# EasyEDA schematic SCH_Poultry-Farm-Prediction-Models-(Field-and-Gateway-Nodes)_2025-12-15.json

## Sheets
1 Gateway Esp 32: TITLE: ESP Gateway; REV: 1.0; Date: 2025-12-15; Sheet: 1/1; Drawn By: davidorhin; Company: Your Company
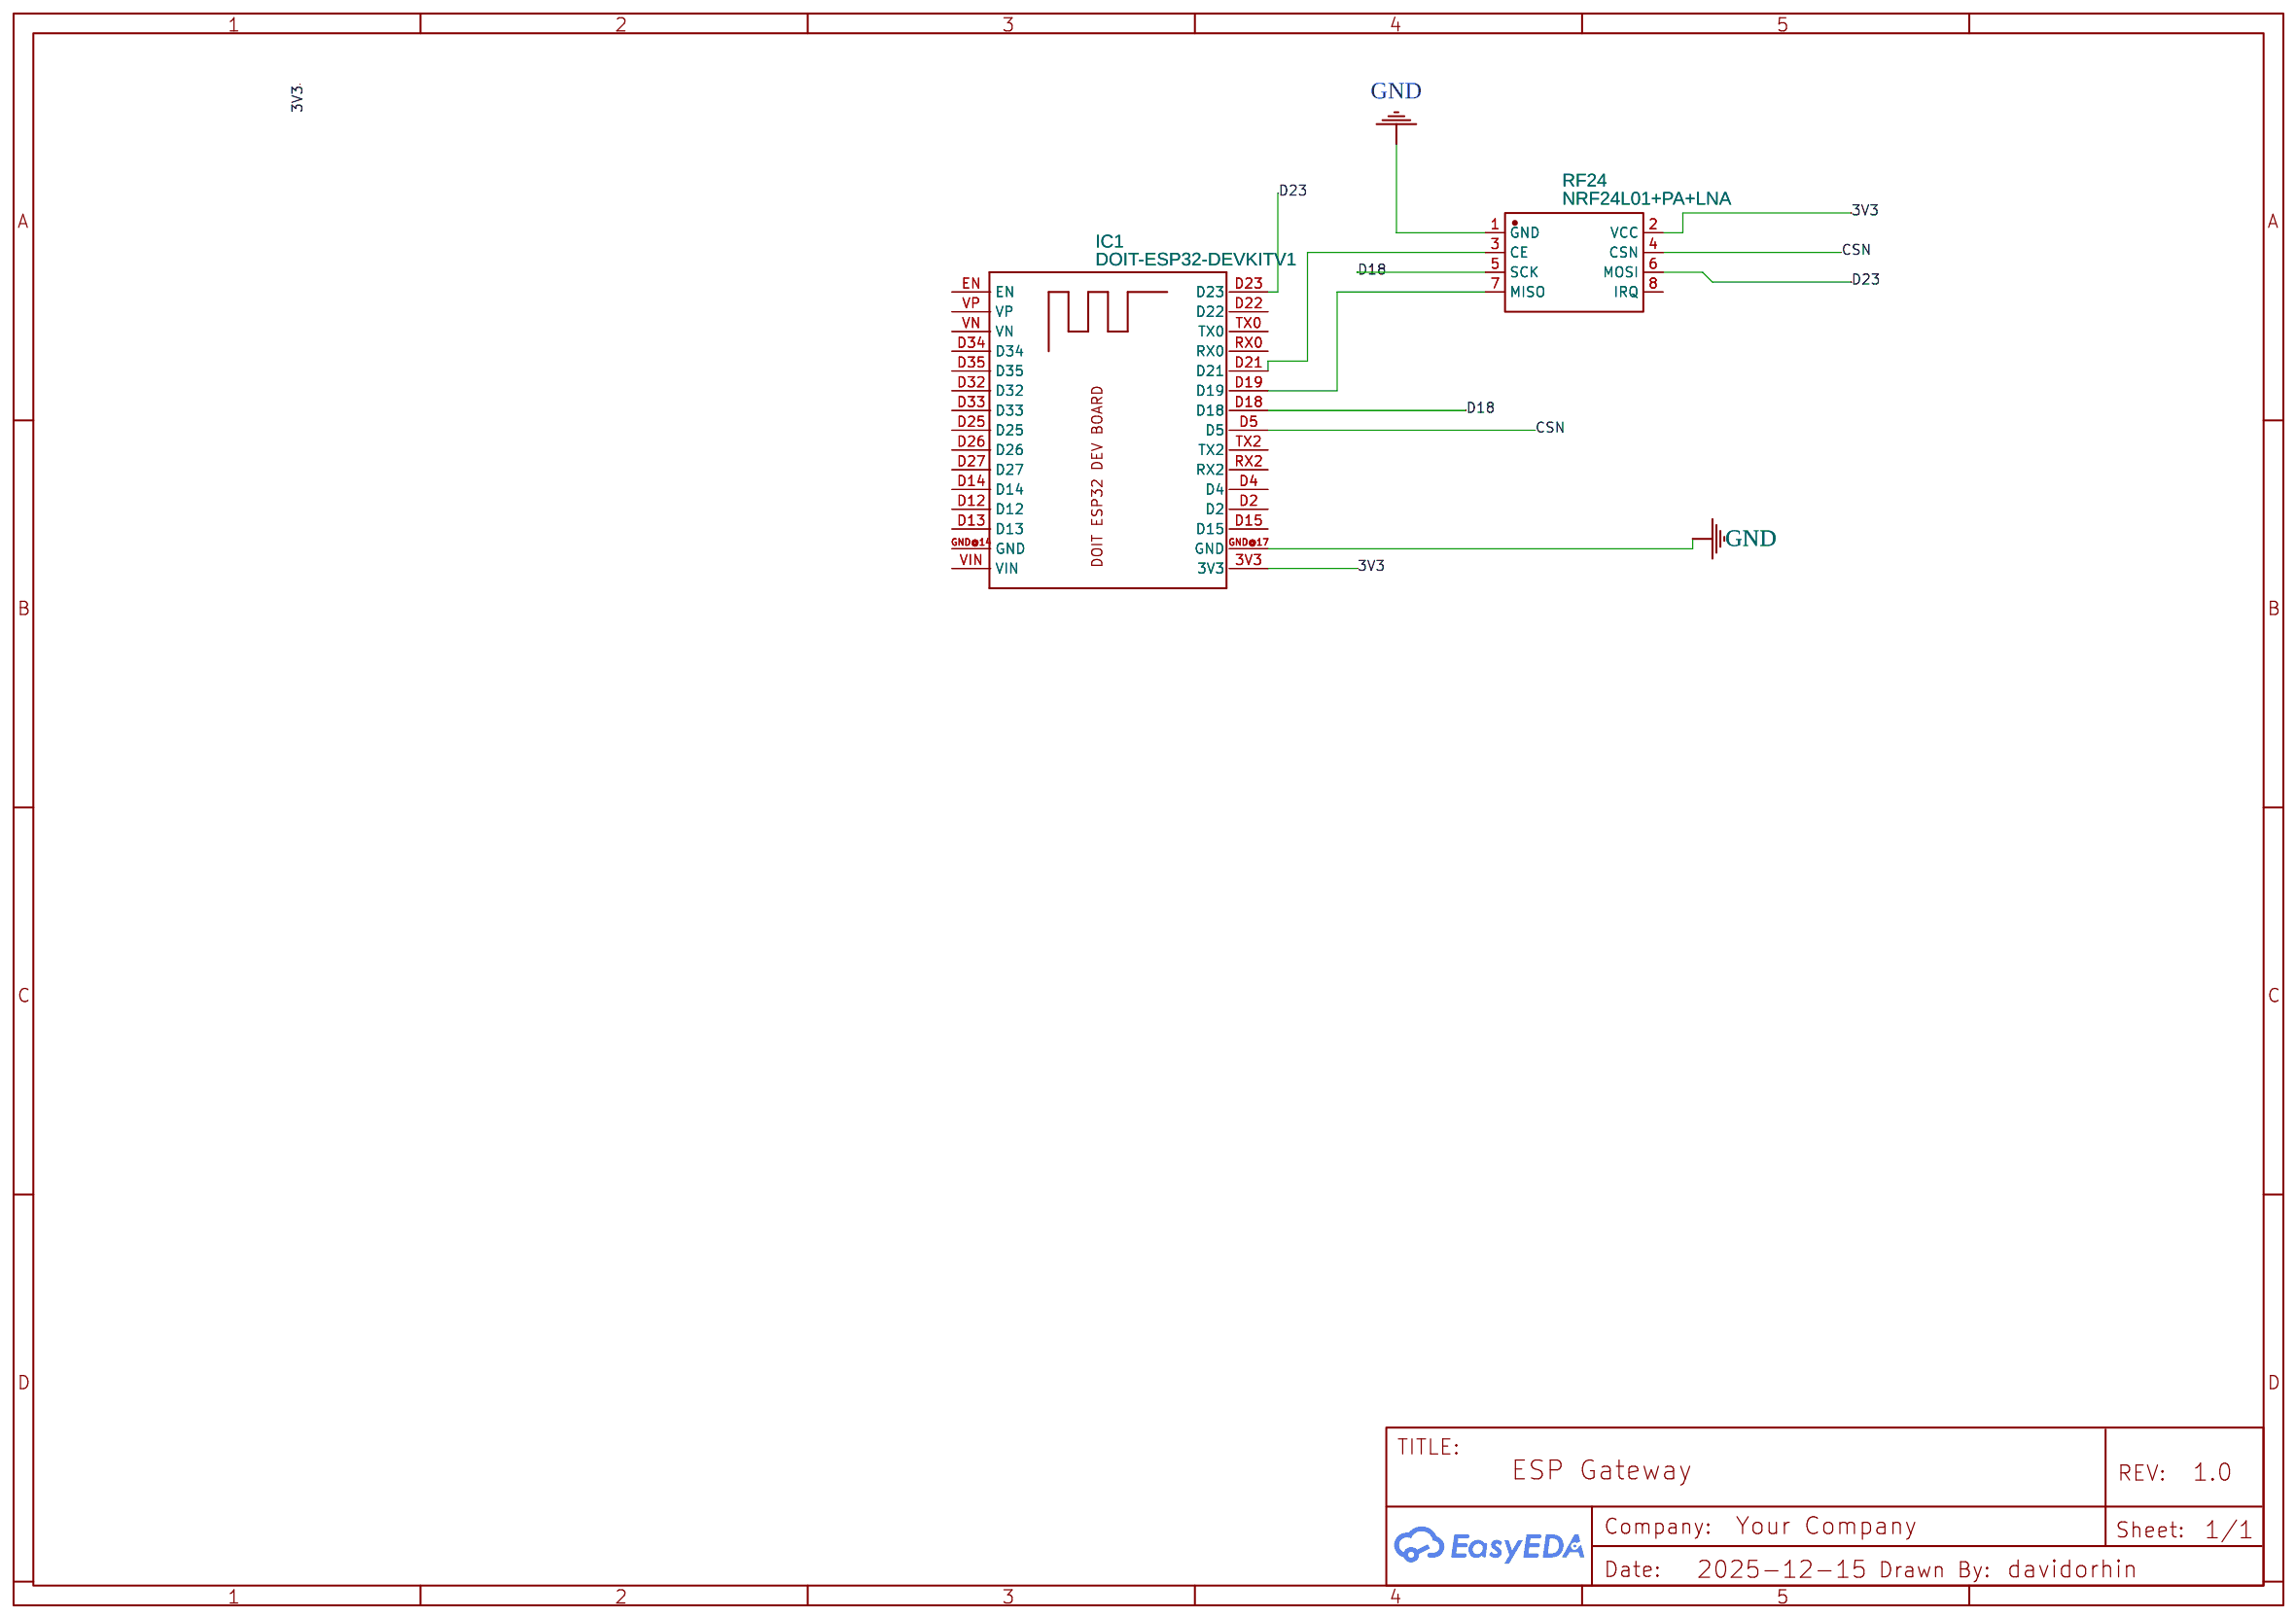
[diagram p0: Gateway Esp 32]
2 Field Nodes Esp 33: TITLE: Node1; Company: Team7
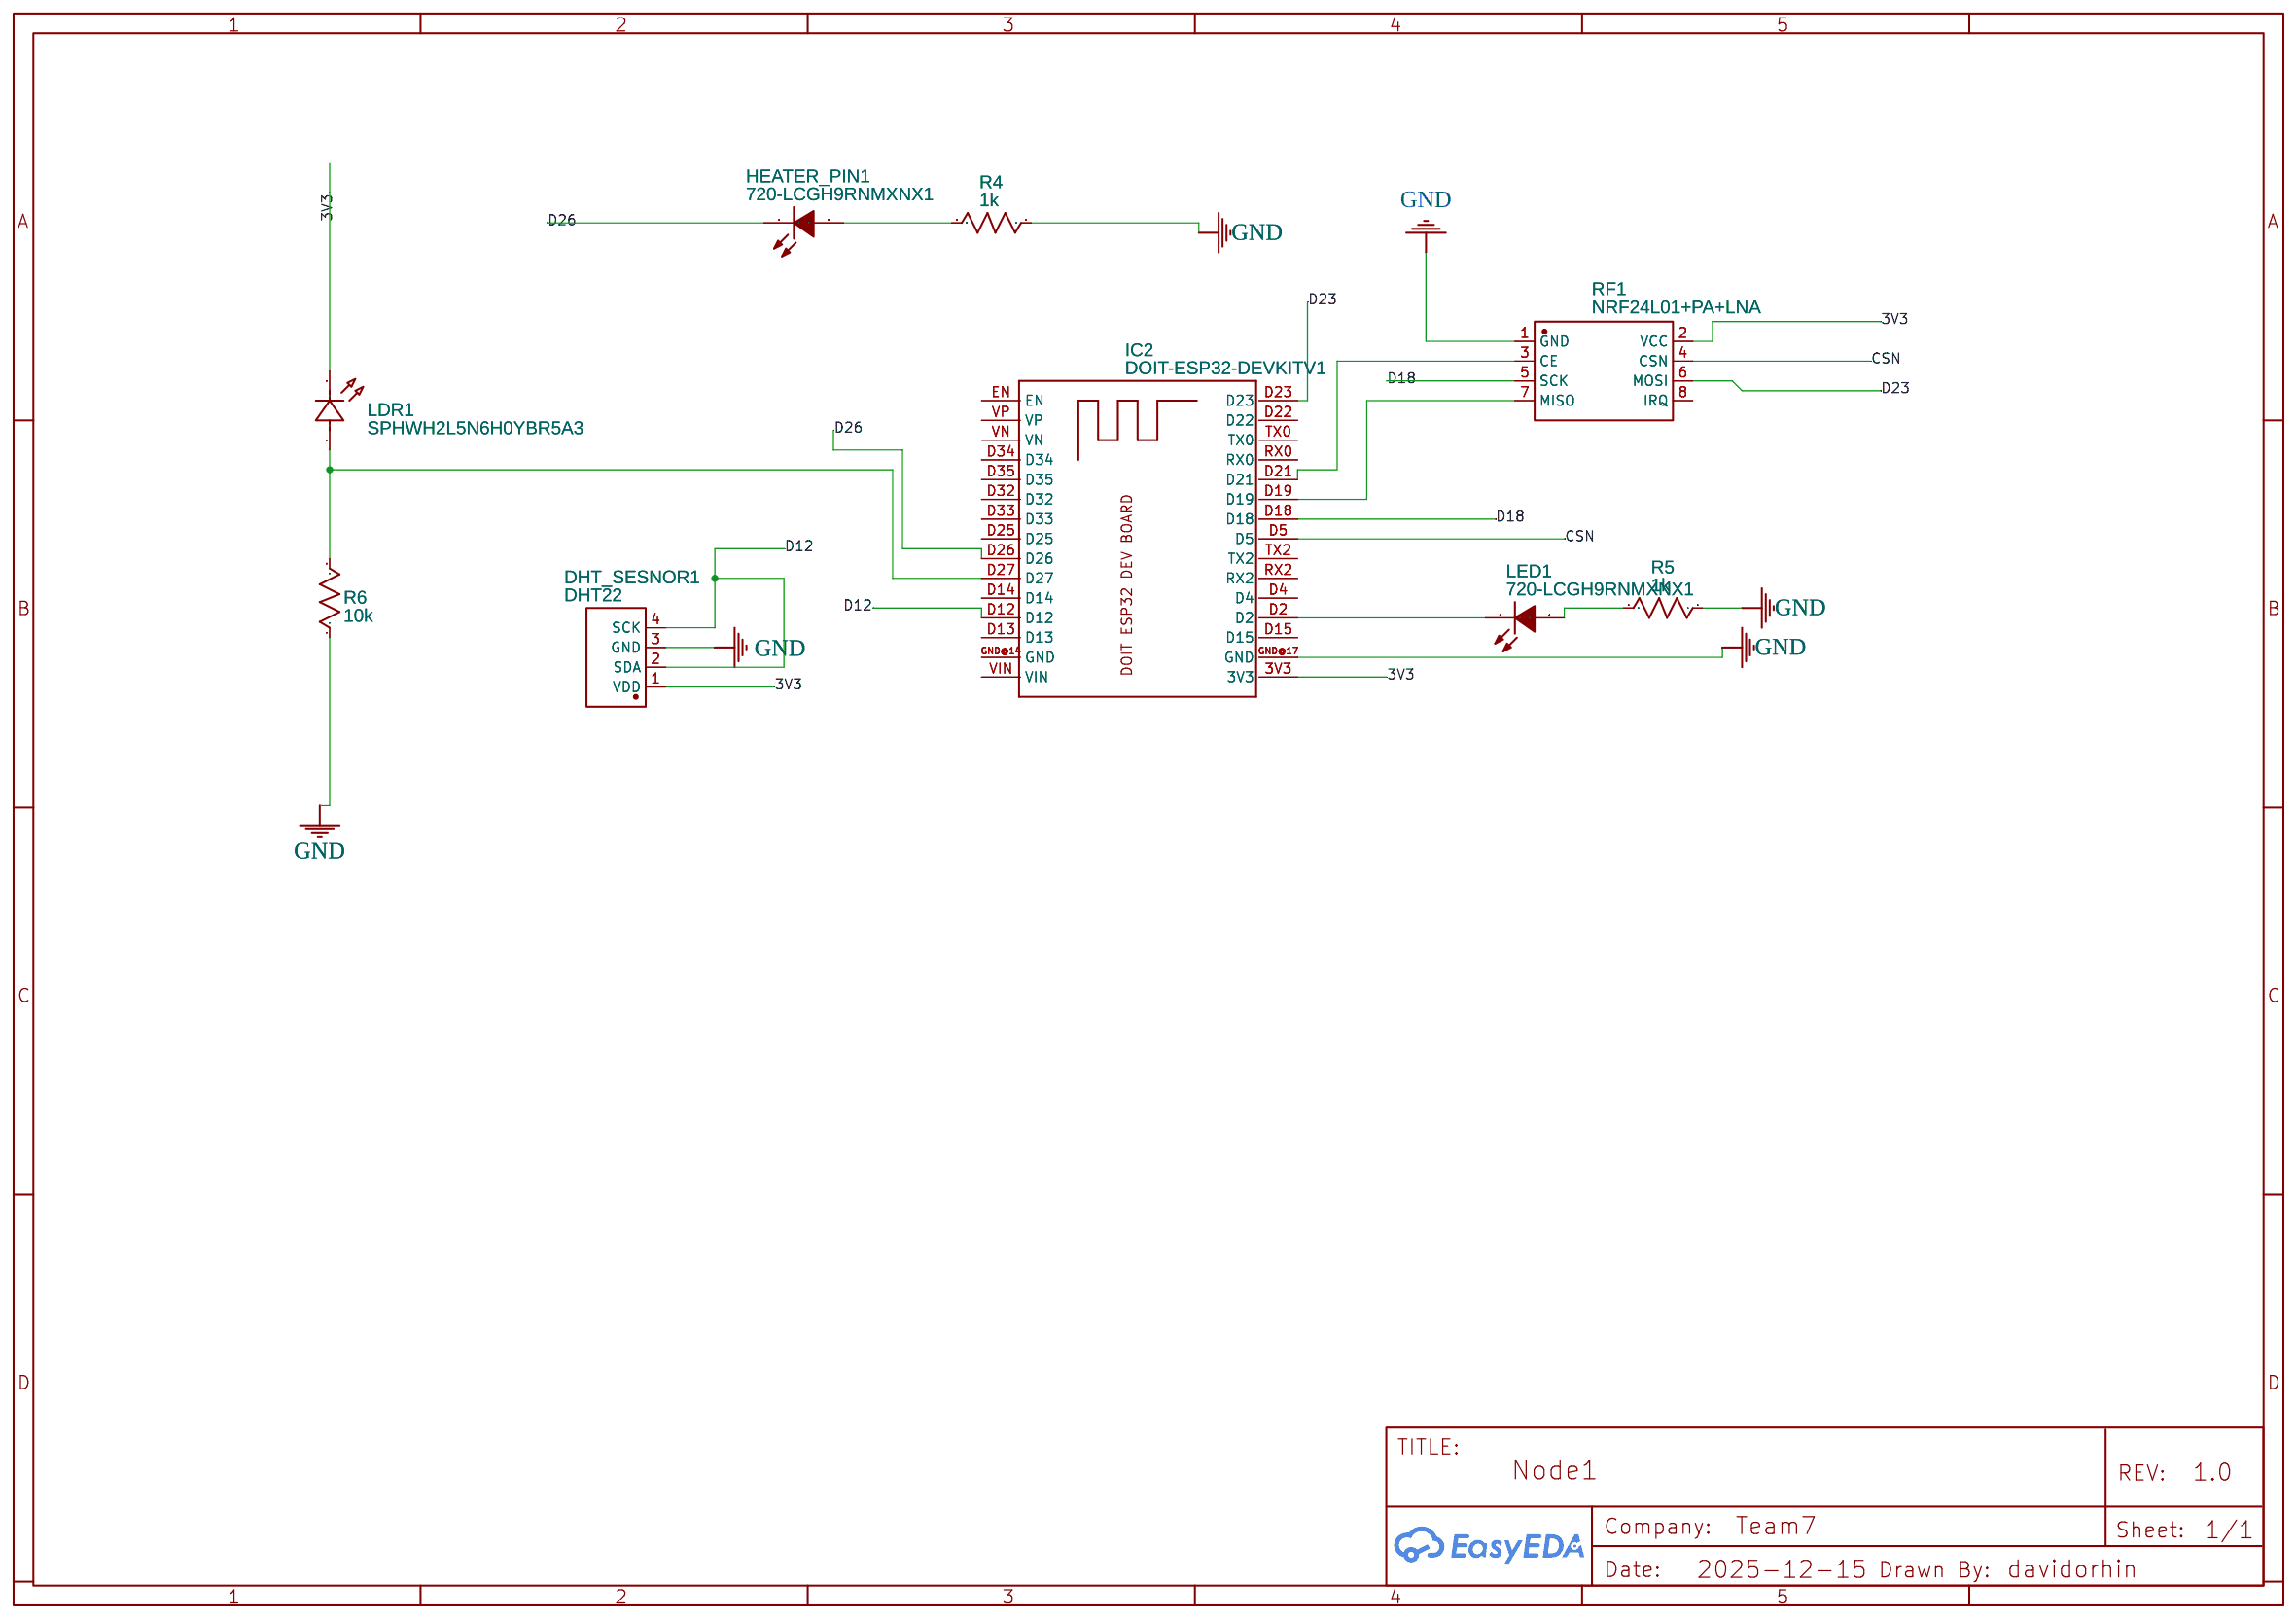
[diagram p1: Field Nodes Esp 33]

## Parts
sheet Field Nodes Esp 33
DHT_SESNOR1  DHT22  [SENSOR-TH_HAIGU_DHT22]
HEATER_PIN1  720-LCGH9RNMXNX1  [LED-SMD_SD65-120-LED]
IC2  DOIT-ESP32-DEVKITV1  [DOIT-ESP32-DEVKITV1]
LDR1  SPHWH2L5N6H0YBR5A3  [LED-SMD_L5.0-W5.0-FD_LDR-5050TEB4070-T3405EP]
LED1  720-LCGH9RNMXNX1  [LED-SMD_SD65-120-LED]
R4  1k  [R0603]
R5  1k  [R0603]
R6  10k  [R0603]
RF1  NRF24L01+PA+LNA  [COMM-TH_L41.0-W15.5-P2.54_NRF24L01]
sheet Gateway Esp 32
IC1  DOIT-ESP32-DEVKITV1  [DOIT-ESP32-DEVKITV1]
RF24  NRF24L01+PA+LNA  [COMM-TH_L41.0-W15.5-P2.54_NRF24L01]

## Library data of the parts
DHT_SESNOR1 = DHT22: Contributor: LCSC; Supplier: LCSC; Supplier Part: C2880291; Manufacturer: HAIGU(广州海谷); JLCPCB Part Class: Extended Part
HEATER_PIN1 LED1 = 720-LCGH9RNMXNX1: Contributor: lcsc; Supplier: LCSC; Supplier Part: C9900019959; Manufacturer: null; JLCPCB Part Class: Extended Part
IC1 IC2 = DOIT-ESP32-DEVKITV1: Contributor: Tim McConnell
LDR1 = SPHWH2L5N6H0YBR5A3: Supplier: LCSC; Supplier Part: C20837402; Manufacturer: SAMSUNG(三星); JLCPCB Part Class: Extended Part; Contributor: lcsc
R4-R6 = R_0603_US: Contributor: LCEDA_Lib
RF1 RF24 = NRF24L01+PA+LNA: Supplier: LCSC; Supplier Part: C9900187674; Manufacturer: null; Manufacturer Part: nRF24L01+PA+LNA; JLCPCB Part Class: Extended Part; Contributor: lcsc

## Nets
3V3: DHT_SESNOR1.1(VDD) IC1.3V3 IC2.3V3 LDR1.1(C) RF1.2(VCC) RF24.2(VCC)
GND: DHT_SESNOR1.3(GND) IC1.GND@17(GND) IC2.GND@17(GND) R4.1 R5.1 R6.1 RF1.1(GND) RF24.1(GND)
CSN: IC1.D5 IC2.D5 RF1.4(CSN) RF24.4(CSN)
D12: DHT_SESNOR1.2(SDA) DHT_SESNOR1.4(SCK) IC2.D12
D18: IC1.D18 IC2.D18 RF1.5(SCK) RF24.5(SCK)
D23: IC1.D23 IC2.D23 RF1.6(MOSI) RF24.6(MOSI)
D26: HEATER_PIN1.1(K) IC2.D26
Net-(HEATER_PIN1-2): HEATER_PIN1.2(A) R4.2
Net-(IC1-D19): IC1.D19 RF24.7(MISO)
Net-(IC1-D21): IC1.D21 RF24.3(CE)
Net-(IC2-D2): IC2.D2 LED1.1(K)
Net-(IC2-D19): IC2.D19 RF1.7(MISO)
Net-(IC2-D21): IC2.D21 RF1.3(CE)
Net-(IC2-D27): IC2.D27 LDR1.2(A) R6.2
Net-(LED1-2): LED1.2(A) R5.2

Not connected (* = marked no-connect by the designer): IC1 D2 D4 D12 D13 D14 D15 D22 D25 D26 D27 D32 D33 D34 D35 EN GND@14(GND) RX0 RX2 TX0 TX2 VIN VN VP; IC2 D4 D13 D14 D15 D22 D25 D32 D33 D34 D35 EN GND@14(GND) RX0 RX2 TX0 TX2 VIN VN VP; RF1 8(IRQ); RF24 8(IRQ)
